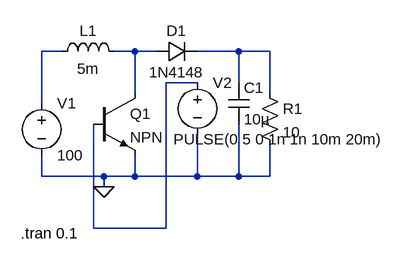
[diagram p0: schematic step_up_chopper_diode_circuit.asc]
step_up_chopper_diode_circuit.asc, the LTspice schematic file:
Version 4
SHEET 1 880 680
WIRE 176 80 144 80
WIRE 288 80 256 80
WIRE 320 80 288 80
WIRE 448 80 384 80
WIRE 496 80 448 80
WIRE 384 128 336 128
WIRE 448 128 448 80
WIRE 288 144 288 80
WIRE 496 144 496 80
WIRE 144 160 144 80
WIRE 144 272 144 240
WIRE 240 272 144 272
WIRE 288 272 288 240
WIRE 288 272 240 272
WIRE 384 272 384 208
WIRE 384 272 288 272
WIRE 448 272 448 192
WIRE 448 272 384 272
WIRE 496 272 496 224
WIRE 496 272 448 272
WIRE 240 288 240 272
WIRE 224 352 224 192
WIRE 336 352 336 128
WIRE 336 352 224 352
FLAG 240 288 0
SYMBOL ind 160 96 R270
WINDOW 0 32 56 VTop 2
WINDOW 3 5 56 VBottom 2
SYMATTR InstName L1
SYMATTR Value 5m
SYMBOL diode 320 96 R270
WINDOW 0 32 32 VTop 2
WINDOW 3 0 32 VBottom 2
SYMATTR InstName D1
SYMATTR Value 1N4148
SYMBOL res 480 128 R0
SYMATTR InstName R1
SYMATTR Value 10
SYMBOL voltage 144 144 R0
WINDOW 123 0 0 Left 0
WINDOW 39 0 0 Left 0
SYMATTR InstName V1
SYMATTR Value 100
SYMBOL npn 224 144 R0
SYMATTR InstName Q1
SYMBOL voltage 384 112 R0
WINDOW 3 -37 103 Left 2
WINDOW 123 0 0 Left 0
WINDOW 39 0 0 Left 0
SYMATTR Value PULSE(0 5 0 1n 1n 10m 20m)
SYMATTR InstName V2
SYMBOL cap 432 128 R0
SYMATTR InstName C1
SYMATTR Value 10µ
TEXT 112 360 Left 2 !.tran 0.1

The netlist it stands for:
* step_up_chopper_diode_circuit.asc
L1 N001 N002 5m
D1 N002 N003 1N4148
R1 N003 0 10
V1 N001 0 100
Q1 N002 N004 0 0 NPN
V2 N004 0 PULSE(0 5 0 1n 1n 10m 20m)
C1 N003 0 10µ
.model D D
.lib standard.dio
.model NPN NPN
.model PNP PNP
.lib standard.bjt
.tran 0.1
.backanno
.end